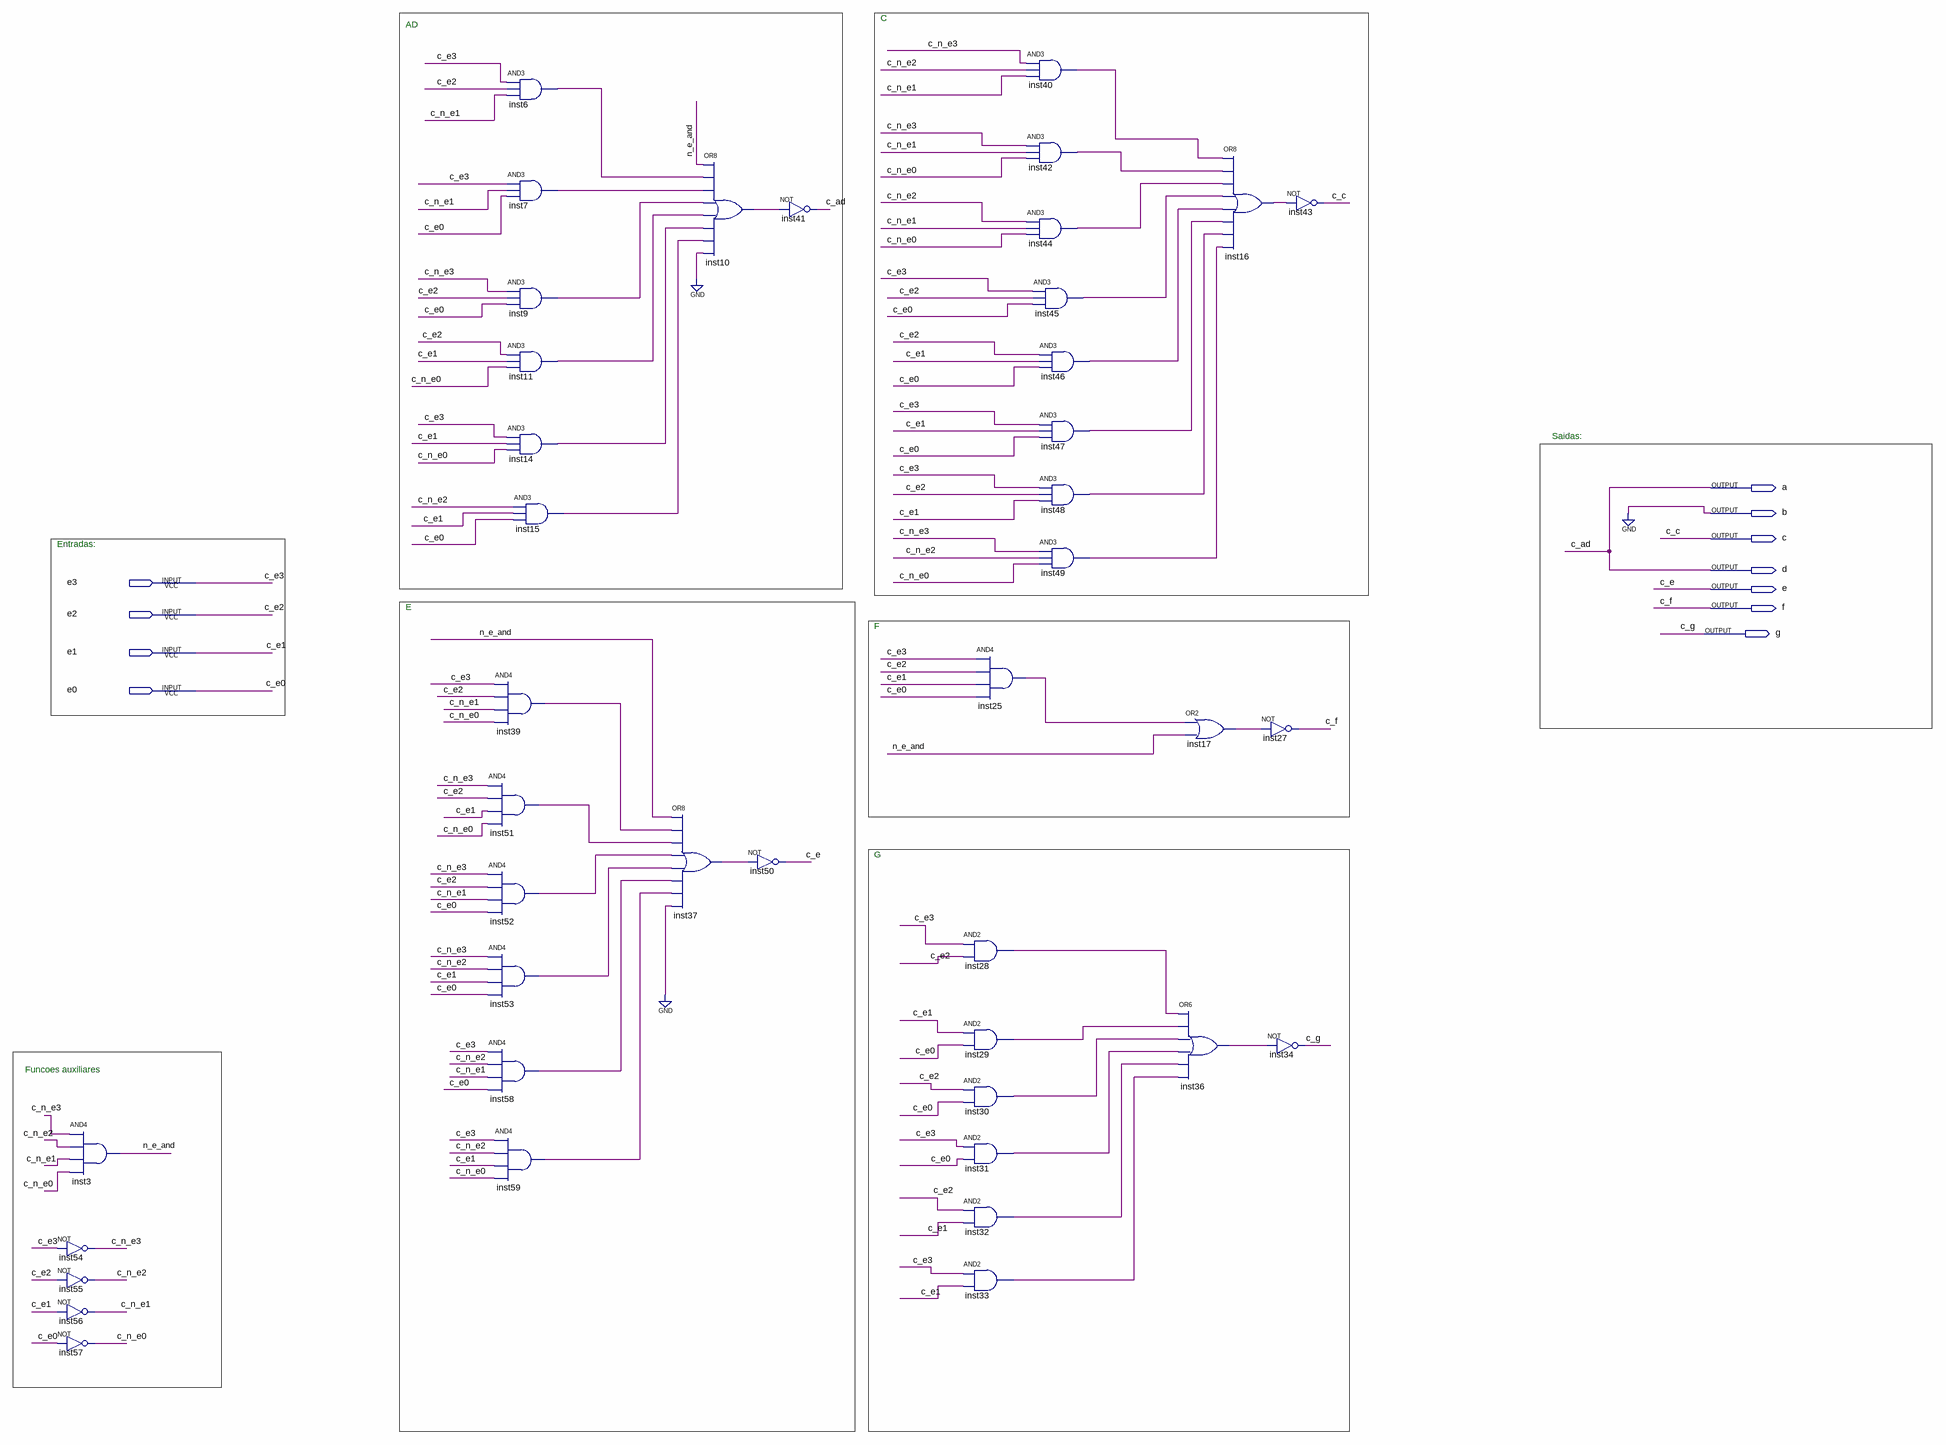
[diagram p0: schematic sheet]
// Quartus schematic numero_apertados_4.bdf as structural Verilog: 42 symbols, 11 pins
module numero_apertados_4 (
  input  e3,
  input  e2,
  input  e1,
  input  e0,
  output a,
  output b,
  output c,
  output d,
  output e,
  output f,
  output g
);

  wire c_n_e0, c_n_e1, c_n_e2, c_n_e3, inst6_out, inst7_out, inst9_out, inst10_out, inst11_out, inst14_out,
       inst15_out, inst16_out, inst17_out, inst25_out, inst28_out, inst29_out, inst30_out, inst31_out,
       inst32_out, inst33_out, inst36_out, inst37_out, inst39_out, inst40_out, inst42_out, inst44_out,
       inst45_out, inst46_out, inst47_out, inst48_out, inst49_out, inst51_out, inst52_out, inst53_out,
       inst58_out, inst59_out, n_e_and;

  and inst3 (n_e_and, c_n_e3, c_n_e2, c_n_e1, c_n_e0);
  not inst54 (c_n_e3, e3);
  not inst55 (c_n_e2, e2);
  not inst56 (c_n_e1, e1);
  not inst57 (c_n_e0, e0);
  and inst6 (inst6_out, e3, e2, c_n_e1);
  and inst7 (inst7_out, e3, c_n_e1, e0);
  and inst9 (inst9_out, c_n_e3, e2, e0);
  and inst11 (inst11_out, e2, e1, c_n_e0);
  and inst14 (inst14_out, e3, e1, c_n_e0);
  and inst15 (inst15_out, c_n_e2, e1, e0);
  and inst39 (inst39_out, e3, e2, c_n_e1, c_n_e0);
  and inst51 (inst51_out, c_n_e3, e2, e1, c_n_e0);
  and inst52 (inst52_out, c_n_e3, e2, c_n_e1, e0);
  and inst53 (inst53_out, c_n_e3, c_n_e2, e1, e0);
  and inst58 (inst58_out, e3, c_n_e2, c_n_e1, e0);
  and inst59 (inst59_out, e3, c_n_e2, e1, c_n_e0);
  or inst37 (inst37_out, n_e_and, inst39_out, inst51_out, inst52_out, inst53_out, inst58_out, inst59_out, 1'b0);
  or inst10 (inst10_out, n_e_and, inst6_out, inst7_out, inst9_out, inst11_out, inst14_out, inst15_out, 1'b0);
  not inst41 (a, inst10_out);
  not inst50 (e, inst37_out);
  and inst25 (inst25_out, e3, e2, e1, e0);
  and inst28 (inst28_out, e3, e2);
  and inst29 (inst29_out, e1, e0);
  and inst30 (inst30_out, e2, e0);
  and inst31 (inst31_out, e3, e0);
  and inst32 (inst32_out, e2, e1);
  and inst33 (inst33_out, e3, e1);
  and inst40 (inst40_out, c_n_e3, c_n_e2, c_n_e1);
  and inst42 (inst42_out, c_n_e3, c_n_e1, c_n_e0);
  and inst44 (inst44_out, c_n_e2, c_n_e1, c_n_e0);
  and inst45 (inst45_out, e3, e2, e0);
  and inst46 (inst46_out, e2, e1, e0);
  and inst47 (inst47_out, e3, e1, e0);
  and inst48 (inst48_out, e3, e2, e1);
  and inst49 (inst49_out, c_n_e3, c_n_e2, c_n_e0);
  or inst17 (inst17_out, inst25_out, n_e_and);
  or inst36 (inst36_out, inst28_out, inst29_out, inst30_out, inst31_out, inst32_out, inst33_out);
  or inst16 (inst16_out, inst40_out, inst42_out, inst44_out, inst45_out, inst46_out, inst47_out, inst48_out, inst49_out);
  not inst43 (c, inst16_out);
  not inst27 (f, inst17_out);
  not inst34 (g, inst36_out);

  assign b = 1'b0;
  assign d = a;

  // Other names for the same wires on the sheet: c_ad = a; c_c = c; c_e = e; c_e0 = e0; c_e1 = e1; c_e2 = e2;
  //   c_e3 = e3; c_f = f; c_g = g

  // Notes on the sheet:
  //   C
  //   AD
  //   Saidas:
  //   Entradas:
  //   E
  //   F
  //   G
  //   Funcoes auxiliares
endmodule
